# EAGLE design industrialSensorModule (EAGLE 7.1.0)
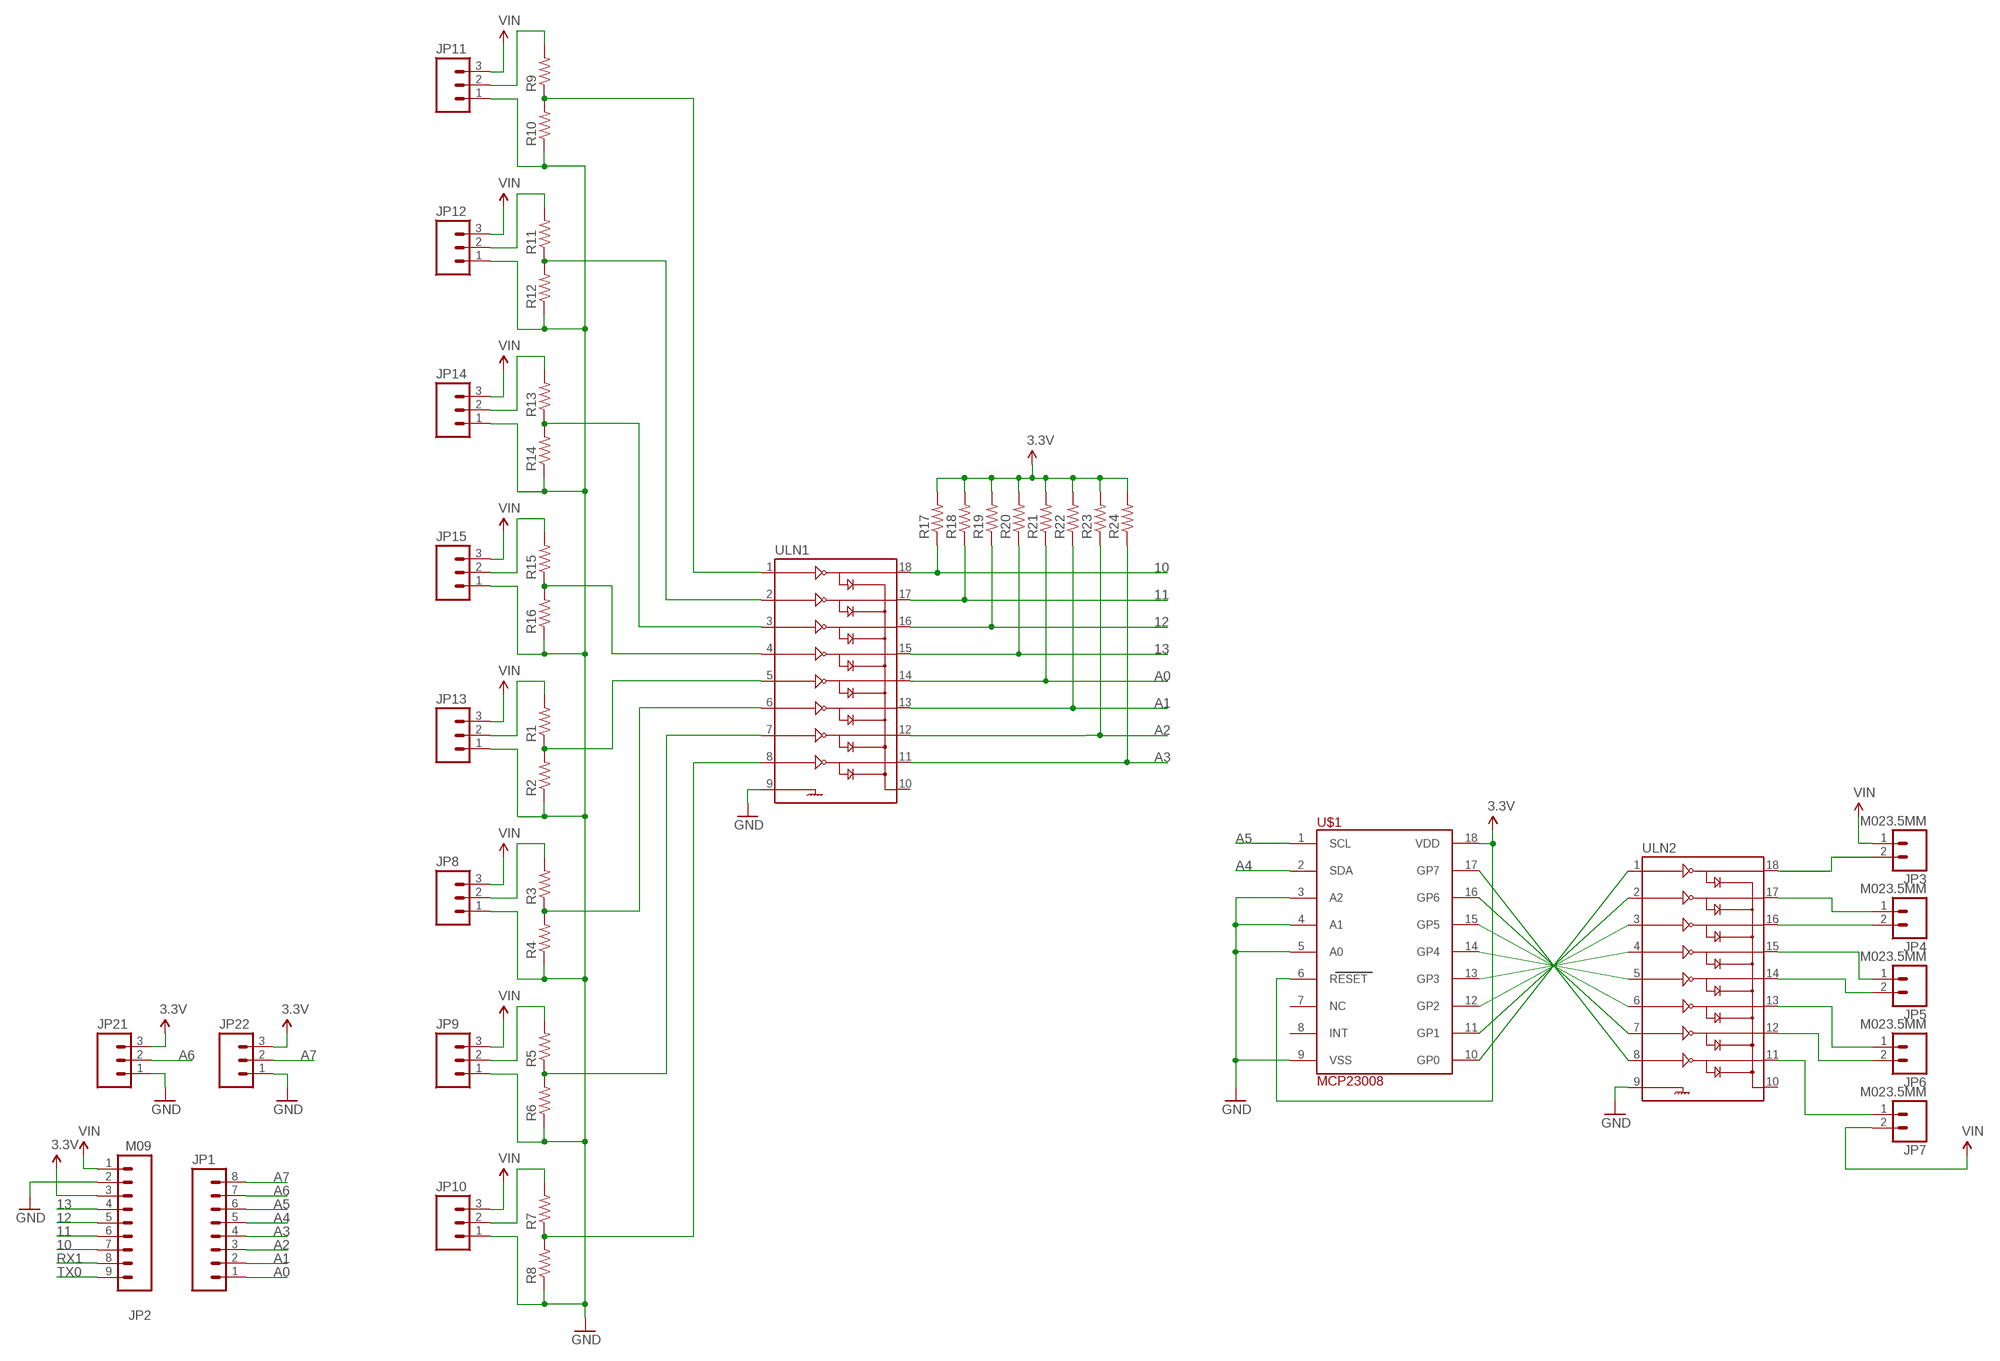
[diagram p0: schematic, sheet 1]

## Parts
JP1  M081X08  [1X08]
JP2  M09  [1X09]
JP3  M023.5MM  [SCREWTERMINAL-3.5MM-2]
JP4  M023.5MM  [SCREWTERMINAL-3.5MM-2]
JP5  M023.5MM  [SCREWTERMINAL-3.5MM-2]
JP6  M023.5MM  [SCREWTERMINAL-3.5MM-2]
JP7  M023.5MM  [SCREWTERMINAL-3.5MM-2]
JP8  M03SCREW  [SCREWTERMINAL-3.5MM-3]
JP9  M03SCREW  [SCREWTERMINAL-3.5MM-3]
JP10  M03SCREW  [SCREWTERMINAL-3.5MM-3]
JP11  M03SCREW  [SCREWTERMINAL-3.5MM-3]
JP12  M03SCREW  [SCREWTERMINAL-3.5MM-3]
JP13  M03SCREW  [SCREWTERMINAL-3.5MM-3]
JP14  M03SCREW  [SCREWTERMINAL-3.5MM-3]
JP15  M03SCREW  [SCREWTERMINAL-3.5MM-3]
JP21  M03SCREW  [SCREWTERMINAL-3.5MM-3]
JP22  M03SCREW  [SCREWTERMINAL-3.5MM-3]
R1  RESISTOR1206  [1206]
R2  RESISTOR1206  [1206]
R3  RESISTOR1206  [1206]
R4  RESISTOR1206  [1206]
R5  RESISTOR1206  [1206]
R6  RESISTOR1206  [1206]
R7  RESISTOR1206  [1206]
R8  RESISTOR1206  [1206]
R9  RESISTOR1206  [1206]
R10  RESISTOR1206  [1206]
R11  RESISTOR1206  [1206]
R12  RESISTOR1206  [1206]
R13  RESISTOR1206  [1206]
R14  RESISTOR1206  [1206]
R15  RESISTOR1206  [1206]
R16  RESISTOR1206  [1206]
R17  RESISTOR1206  [1206]
R18  RESISTOR1206  [1206]
R19  RESISTOR1206  [1206]
R20  RESISTOR1206  [1206]
R21  RESISTOR1206  [1206]
R22  RESISTOR1206  [1206]
R23  RESISTOR1206  [1206]
R24  RESISTOR1206  [1206]
U$1  MCP23008  [SOICW-18]
ULN1  ULN2803SOICW  [SO18L]
ULN2  ULN2803SOICW  [SO18L]

## Nets
3.3V: JP2.3 JP21.3 JP22.3 R17.2 R18.2 R19.2 R20.2 R21.2 R22.2 R23.2 R24.2 U$1.6(RESET) U$1.18(VDD)
10: JP2.7 R17.1 ULN1.18
11: JP2.6 R18.1 ULN1.17
12: JP2.5 R19.1 ULN1.16
13: JP2.4 R20.1 ULN1.15
A0: JP1.1 R21.1 ULN1.14
A1: JP1.2 R22.1 ULN1.13
A2: JP1.3 R23.1 ULN1.12
A3: JP1.4 R24.1 ULN1.11
A4: JP1.5 U$1.2(SDA)
A5: JP1.6 U$1.1(SCL)
A6: JP1.7 JP21.2
A7: JP1.8 JP22.2
GND: JP2.2 JP8.1 JP9.1 JP10.1 JP11.1 JP12.1 JP13.1 JP14.1 JP15.1 JP21.1 JP22.1 R2.1 R4.1 R6.1 R8.1 R10.1 R12.1 R14.1 R16.1 U$1.3(A2) U$1.4(A1) U$1.5(A0) U$1.9(VSS) ULN1.9 ULN2.9
N$1: R1.1 R2.2 ULN1.5
N$2: JP13.2 R1.2
N$4: R3.1 R4.2 ULN1.6
N$5: JP8.2 R3.2
N$7: R5.1 R6.2 ULN1.7
N$8: JP9.2 R5.2
N$10: R7.1 R8.2 ULN1.8
N$11: JP10.2 R7.2
N$13: R9.1 R10.2 ULN1.1
N$14: JP11.2 R9.2
N$16: R11.1 R12.2 ULN1.2
N$17: JP12.2 R11.2
N$19: R13.1 R14.2 ULN1.3
N$20: JP14.2 R13.2
N$22: R15.1 R16.2 ULN1.4
N$23: JP15.2 R15.2
N$25: U$1.10(GP0) ULN2.1
N$26: U$1.11(GP1) ULN2.2
N$27: U$1.12(GP2) ULN2.3
N$28: U$1.13(GP3) ULN2.4
N$29: U$1.14(GP4) ULN2.5
N$30: U$1.15(GP5) ULN2.6
N$31: U$1.16(GP6) ULN2.7
N$32: U$1.17(GP7) ULN2.8
N$33: JP3.2 ULN2.18
N$34: JP4.1 ULN2.17
N$35: JP4.2 ULN2.16
N$36: JP5.1 ULN2.15
N$37: JP5.2 ULN2.14
N$38: JP6.1 ULN2.13
N$39: JP6.2 ULN2.12
N$40: JP7.1 ULN2.11
RX1: JP2.8
TX0: JP2.9
VIN: JP2.1 JP3.1 JP7.2 JP8.3 JP9.3 JP10.3 JP11.3 JP12.3 JP13.3 JP14.3 JP15.3
Unconnected: U$1.7(NC) U$1.8(INT) ULN1.10 ULN2.10

## Library data of the parts
JP1 = SparkFun-Connectors:M08: Header 8 Standard 8-pin 0.1" header. Use with straight break away headers (SKU : PRT-00116), right angle break away headers (PRT-00553), swiss pins (PRT-00743), machine pins (PRT-00117), and female headers (PRT-00115).
JP2 = SparkFun-Connectors:M09: Header 9 Standard 9-pin 0.1" header. Use with straight break away headers (SKU : PRT-00116), right angle break away headers (PRT-00553), swiss pins (PRT-00743), machine pins (PRT-00117), and female headers (PRT-00115).
JP3-JP7 = SparkFun-Connectors:M02: Standard 2-pin 0.1" header. Use with - straight break away headers ( PRT-00116) - right angle break away headers (PRT-00553) - swiss pins (PRT-00743) - machine pins (PRT-00117) - female headers (PRT-00115) Molex polarized connector foot print use with: PRT-08233 with associated crimp pins and housings. 2.54_SCREWTERM for use with PRT-10571. 3.5mm Screw Terminal footprints for PRT-08084 5mm Screw Terminal footprints for use with PRT-08433
JP8-JP15 JP21 JP22 = SparkFun-Connectors:M03: Header 3 Standard 3-pin 0.1" header. Use with straight break away headers (SKU : PRT-00116), right angle break away headers (PRT-00553), swiss pins (PRT-00743), machine pins (PRT-00117), and female headers (PRT-00115). Molex polarized connector foot print use with SKU : PRT-08232 with associated crimp pins and housings.
R1-R24 = SparkFun-Passives:RESISTOR: Resistor Basic schematic elements and footprints for 0603, 1206, and PTH resistors.
U$1 = myLibrary:MCP23008
ULN1 ULN2 = SparkFun-PowerIC:ULN2803: Darlington Driver ULN2803 Darlington array. 500mA max per channel, 8-channel package. Spark Fun Electronics SKU : COM-00312

## Board
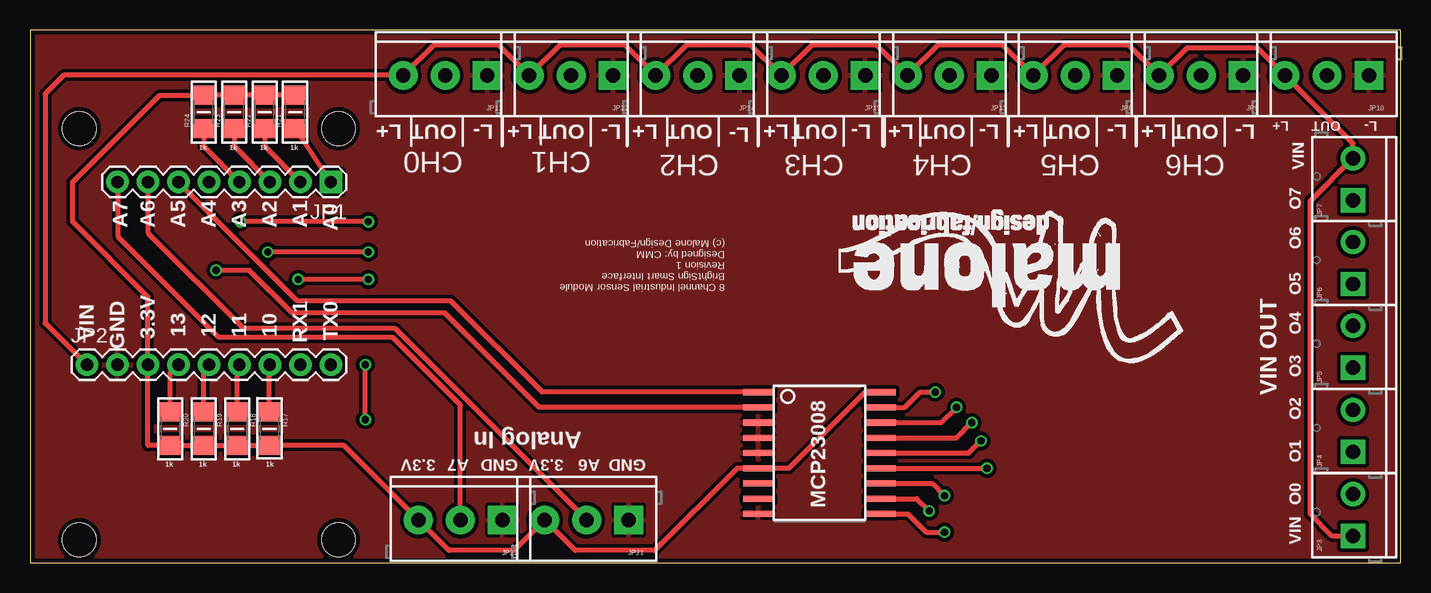
[diagram p1: board, top side]
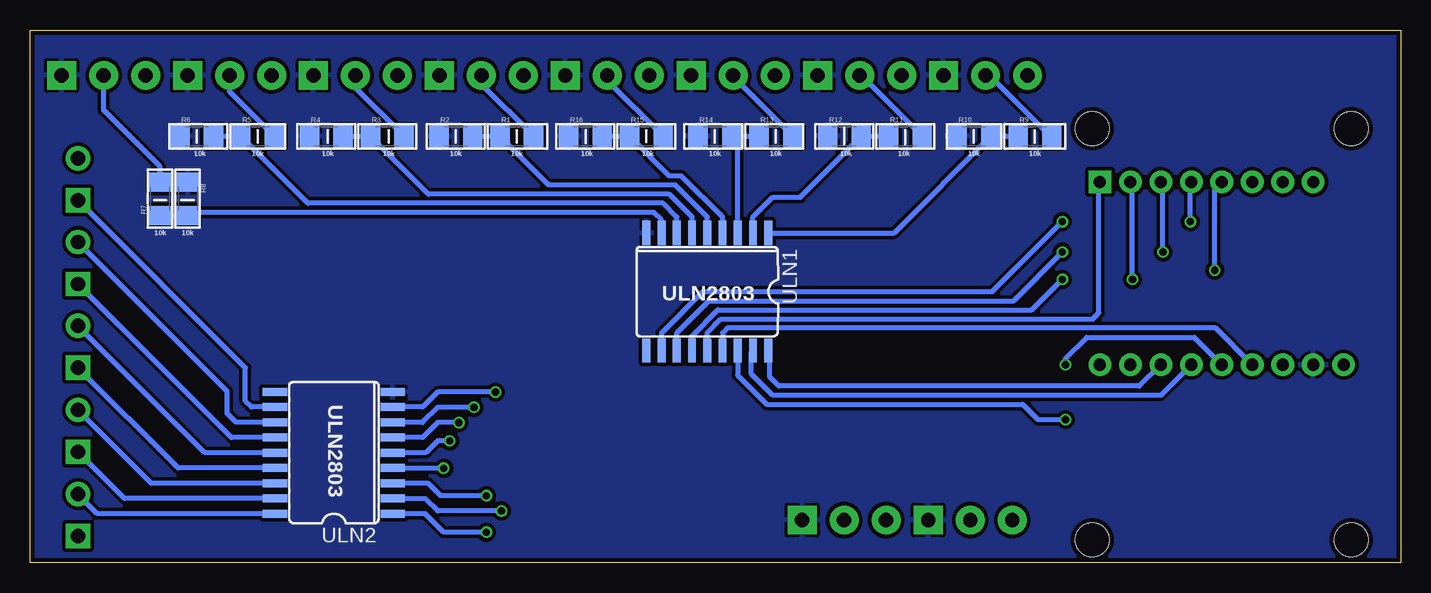
[diagram p2: board, bottom side, seen from below]

Size 114.22 x 44.43 mm. Coordinates in mm from the lower left corner, seen from the top.
Outline: 114.22,0 114.22,44.43 0,44.43 0,0 114.22,0
Copper layers (1*16): Top 0.0356mm / dielectric 1.5011mm / Bottom 0.0356mm
Design rules "LaenPCBOrder": minimum track width 6mil, minimum drill 13mil, track to track 6mil, track to pad 6mil, pad to pad 6mil, via to via 6mil, smd to smd 6mil, copper to edge 15mil, drill to drill 6mil, minimum pad ring 7mil, minimum via ring 7mil, stop-mask expansion 3mil, vias tented up to drill 0mil, thermal gap 10mil
Holes 2.8 mm at 25.7,1.91 25.7,36.2 4.12,1.91 4.12,36.2

### Footprints (pad centres in the part's own frame; a part is rotated, then mirrored left to right if it is on the bottom)
1X08 = drill 1.016 pad 1.88 square: 1 0,0 | drill 1.016 pad 1.88: 2 2.54,0; 3 5.08,0; 4 7.62,0; 5 10.16,0; 6 12.7,0; 7 15.24,0; 8 17.78,0
1X09 = drill 1.016 pad 1.88: 1 0,0; 2 2.54,0; 3 5.08,0; 4 7.62,0; 5 10.16,0; 6 12.7,0; 7 15.24,0; 8 17.78,0; 9 20.32,0
SCREWTERMINAL-3.5MM-2 = drill 1.2 pad 2.032 square: 1 0,0 | drill 1.2 pad 2.032: 2 3.5,0
SCREWTERMINAL-3.5MM-3 = drill 1.2 pad 2.413 square: 1 0,0 | drill 1.2 pad 2.413: 2 3.5,0; 3 7,0
1206 = smd 1.6 x 1.8: 1 -1.4,0; 2 1.4,0
SOICW-18 = smd 2.54 x 0.508: 1 -5.08,5.08; 2 -5.08,3.81; 3 -5.08,2.54; 4 -5.08,1.27; 5 -5.08,0; 6 -5.08,-1.27; 7 -5.08,-2.54; 8 -5.08,-3.81; 9 -5.08,-5.08; 10 5.08,-5.08; 11 5.08,-3.81; 12 5.08,-2.54; 13 5.08,-1.27; 14 5.08,0; 15 5.08,1.27; 16 5.08,2.54; 17 5.08,3.81; 18 5.08,5.08
SO18L = smd 0.66 x 2.032: 1 -0.635,-4.902; 2 0.635,-4.902; 3 1.905,-4.902; 4 3.175,-4.902; 5 4.445,-4.902; 6 5.715,-4.902; 7 6.985,-4.902; 8 8.255,-4.902; 9 9.525,-4.902; 10 9.525,4.902; 11 8.255,4.902; 12 6.985,4.902; 13 5.715,4.902; 14 4.445,4.902; 15 3.175,4.902; 16 1.905,4.902; 17 0.635,4.902; 18 -0.635,4.902

### Placement (x,y rotation side)
JP1  25.07,31.75 180 top
JP2  4.75,16.51 0 top
JP3  110.24,2.21 90 top
JP4  110.24,9.25 90 top
JP5  110.24,16.26 90 top
JP6  110.24,23.24 90 top
JP7  110.24,30.23 90 top
JP8  90.6,40.64 180 top
JP9  101.09,40.64 180 top
JP10  111.58,40.64 180 top
JP11  38.1,40.64 180 top
JP12  48.59,40.64 180 top
JP13  80.11,40.64 180 top
JP14  59.13,40.64 180 top
JP15  69.62,40.64 180 top
JP21  49.89,3.56 180 top
JP22  39.37,3.56 180 top
R1  73.66,35.56 0 bottom
R2  78.74,35.56 0 bottom
R3  84.46,35.56 0 bottom
R4  89.54,35.56 0 bottom
R5  95.25,35.56 0 bottom
R6  100.33,35.56 0 bottom
R7  103.38,30.35 90 bottom
R8  101.09,30.35 270 bottom
R9  30.48,35.56 0 bottom
R10  35.56,35.56 0 bottom
R11  41.28,35.56 0 bottom
R12  46.36,35.56 0 bottom
R13  52.07,35.56 0 bottom
R14  57.15,35.56 0 bottom
R15  62.87,35.56 0 bottom
R16  67.95,35.56 0 bottom
R17  19.94,11.18 270 top
R18  17.27,11.18 270 top
R19  14.48,11.18 270 top
R20  11.68,11.18 270 top
R21  22.1,37.59 90 top
R22  19.56,37.59 90 top
R23  17.02,37.59 90 top
R24  14.48,37.59 90 top
U$1  65.79,9.14 0 top
U$2  [MALONE_LOGO]  96.01,30.73 180 top
ULN1  53.34,22.61 180 bottom
ULN2  88.9,4.72 90 bottom

### Tracks (layer width: path | path; a pad name or v marks a point on that pad's centre or on a via)
3.3V
  Top 0.406: R21.2 R22.2 R23.2 R24.2 10.8,38.99 3.56,31.75 3.56,28.45 9.83,22.17 JP2.3 9.83,9.78 R20.2 R19.2 R18.2 R17.2 26.15,9.78 JP22.3 34.91,1.02 40.35,1.02 JP21.3 45.43,1.02 52.07,1.02 58.93,7.87 U$1.6 63.25,7.87 69.6,14.22 U$1.18
10
  Top 0.406: R17.1 19.94,16.46 JP2.7
  Bottom 0.406: JP2.7 21.77,14.73 51.82,14.73 52.58,15.49 52.58,17.58 ULN1.18
11
  Top 0.406: R18.1 17.27,16.33 JP2.6
  Bottom 0.406: JP2.6 19.99,13.97 52.32,13.97 54.1,15.75 54.1,17.58 ULN1.17
12  (via drill 0.6)
  Top 0.406: R19.1 14.48,16.08 JP2.5 | v27.94,11.94 v27.94,16.51
  Bottom 0.406: ULN1.16 55.25,15.62 52.83,13.21 31.5,13.21 30.23,11.94 v27.94,11.94 | v27.94,16.51 27.94,17.02 26.16,18.8 17.2,18.8 JP2.5
13
  Top 0.406: R20.1 11.68,15.82 JP2.4
  Bottom 0.406: JP2.4 15.42,19.56 56.13,19.56 56.52,19.18 ULN1.15
A0
  Top 0.406: R21.1 JP1.1
  Bottom 0.406: ULN1.14 57.79,19.18 56.64,20.32 25.65,20.32 25.15,20.83 25.15,31.67 JP1.1
A1  (via drill 0.6)
  Top 0.406: R22.1 19.56,34.72 JP1.2 | v28.19,23.62 v22.35,23.62
  Bottom 0.406: ULN1.13 59.06,18.92 56.9,21.08 30.73,21.08 v28.19,23.62 | v22.35,23.62 22.35,31.57 JP1.2
A2  (via drill 0.6)
  Top 0.406: R23.1 17.02,34.72 JP1.3 | v28.19,25.91 v19.81,25.91
  Bottom 0.406: ULN1.12 60.33,19.18 57.66,21.84 32.26,21.84 v28.19,25.91 | v19.81,25.91 19.81,31.57 JP1.3
A3  (via drill 0.6)
  Top 0.406: R24.1 14.48,34.72 JP1.4 | v28.19,28.45 v17.53,28.45
  Bottom 0.406: ULN1.11 61.6,19.18 58.17,22.61 34.04,22.61 v28.19,28.45 | v17.53,28.45 17.53,31.67 JP1.4
A4  (via drill 0.6)
  Top 0.406: U$1.2 42.42,12.95 34.54,20.83 21.84,20.83 18.29,24.38 v15.49,24.38
  Bottom 0.406: v15.49,24.38 15.49,31.17 JP1.5
A5
  Top 0.406: U$1.1 42.67,14.22 35.05,21.84 22.28,21.84 JP1.6
A6
  Top 0.406: JP1.7 9.83,27.51 17.78,19.56 30.38,19.56 JP21.2
A7
  Top 0.406: JP22.2 35.87,13.15 30.23,18.8 15.75,18.8 7.37,27.18 7.37,31.67 JP1.8
GND
  pour Bottom (isolate 0.305): 0,44.45 114.22,44.45 114.22,0 0,0
  pour Top (isolate 0.305): 0,0 114.22,0 114.22,44.42 0,44.42
N$1
  Bottom 0.406: R2.2 R1.1 71,31.5 60.45,31.5 57.79,28.83 ULN1.5
N$2
  Bottom 0.406: R1.2 76.61,39.91 JP13.2
N$4
  Bottom 0.406: R4.2 R3.1 81.03,30.73 60.96,30.73 59.06,28.83 ULN1.6
N$5
  Bottom 0.406: R3.2 87.1,39.61 JP8.2
N$7
  Bottom 0.406: R6.2 R5.1 91.06,29.97 61.47,29.97 60.33,28.83 ULN1.7
N$8
  Bottom 0.406: R5.2 97.59,39.3 JP9.2
N$10
  Bottom 0.406: R7.1 R8.2 100.84,29.21 62.23,29.21 61.6,28.57 ULN1.8
N$11
  Bottom 0.406: R7.2 103.38,33.02 108.08,37.72 JP10.2
N$13
  Bottom 0.406: R9.1 R10.2 42.21,27.51 ULN1.1
N$14
  Bottom 0.406: R9.2 29.21,35.56 34.29,40.64 JP11.2
N$16
  Bottom 0.406: R11.1 R12.2 50.04,30.48 52.32,30.48 53.98,28.83 ULN1.2
N$17
  Bottom 0.406: R11.2 44.96,40.64 JP12.2
N$19
  Bottom 0.406: R13.1 R14.2 55.25,35.05 ULN1.3
N$20
  Bottom 0.406: R13.2 55.63,40.52 JP14.2
N$22
  Bottom 0.406: R16.2 R15.1 60.96,32.26 59.94,32.26 56.52,28.83 ULN1.4
N$23
  Bottom 0.406: R15.2 66.12,40.22 JP15.2
N$25  (via drill 0.6)
  Top 0.406: U$1.10 73.15,4.06 74.68,2.54 v76.2,2.54
  Bottom 0.406: v76.2,2.54 79.76,2.54 81.31,4.09 ULN2.1
N$26  (via drill 0.6)
  Top 0.406: U$1.11 73.91,5.33 v74.93,4.32
  Bottom 0.406: v74.93,4.32 80.26,4.32 81.28,5.33 83.97,5.33 ULN2.2
N$27  (via drill 0.6)
  Top 0.406: U$1.12 75.18,6.6 v76.2,5.59
  Bottom 0.406: v76.2,5.59 80.01,5.59 81.03,6.6 83.97,6.6 ULN2.3
N$28  (via drill 0.6)
  Top 0.406: U$1.13 v79.76,7.87
  Bottom 0.406: v79.76,7.87 83.97,7.87 ULN2.4
N$29  (via drill 0.6)
  Top 0.406: U$1.14 78.23,9.14 v79.25,10.16
  Bottom 0.406: v79.25,10.16 80.26,10.16 81.26,9.17 ULN2.5
N$30  (via drill 0.6)
  Top 0.406: U$1.15 77.22,10.41 v78.49,11.68
  Bottom 0.406: v78.49,11.68 80.26,11.68 81.51,10.44 ULN2.6
N$31  (via drill 0.6)
  Top 0.406: U$1.16 75.95,11.68 v77.22,12.95
  Bottom 0.406: v77.22,12.95 80.26,12.95 81.53,11.68 81.56,11.71 ULN2.7
N$32  (via drill 0.6)
  Top 0.406: U$1.17 72.9,12.95 74.17,14.22 v75.44,14.22
  Bottom 0.406: v75.44,14.22 80.26,14.22 81.51,12.98 ULN2.8
N$33
  Bottom 0.406: ULN2.18 108.62,4.09 JP3.2
N$34
  Bottom 0.406: ULN2.17 106.35,5.36 JP4.1
N$35
  Bottom 0.406: ULN2.16 104.12,6.63 JP4.2
N$36
  Bottom 0.406: ULN2.15 101.88,7.9 JP5.1
N$37
  Bottom 0.406: ULN2.14 99.65,9.17 JP5.2
N$38
  Bottom 0.406: ULN2.13 97.43,10.44 JP6.1
N$39
  Bottom 0.406: ULN2.12 97.05,11.71 97.79,12.45 97.79,14.29 JP6.2
N$40
  Bottom 0.406: ULN2.11 95.78,12.98 96.27,13.46 96.27,16.26 JP7.1
VIN
  Top 0.406: JP3.1 108.53,2.21 106.68,4.06 106.68,30.17 JP7.2 110.24,34.99 JP10.3 102.3,42.93 96.38,42.93 JP9.3 91.55,43.18 86.14,43.18 JP8.3 81.06,43.18 75.65,43.18 JP13.3 70.57,43.18 65.16,43.18 JP15.3 60.08,43.18 54.67,43.18 JP14.3 49.59,43.18 44.13,43.18 JP12.3 39.05,43.18 33.64,43.18 JP11.3 2.79,40.64 1.27,39.12 1.27,19.99 JP2.1

### Text on the board
_tsilk: L+ | OUT | L- | L+ | OUT | L- | L+ | OUT | L+ | OUT | L- | L+ | OUT | L- | L+ | OUT | L- | L+ | OUT | L- | L+ | OUT | L- | L- | 1k | 1k | 1k | 1k | CH0 | CH1 | CH2 | CH3 | CH4 | CH5 | CH6 | VIN | A7 | A6 | A5 | A4 | A3 | A2 | A1 | A0 | O7 | 8 Channel Industrial Sensor Module / BrightSign Smart Interface / Revision 1 / Designed by: CMM / (c) Malone Design/Fabrication | O6 | VIN | GND | 3.3V | RX1 | TX0 | O5 | 13 | 12 | 11 | 10 | O4 | O3 | VIN OUT | O2 | Analog In | 3.3V | A7 | GND | 3.3V | A6 | GND | 1k | 1k | 1k | 1k | O1 | MCP23008 | O0 | VIN
_bsilk: 10k | 10k | 10k | 10k | 10k | 10k | 10k | 10k | 10k | 10k | 10k | 10k | 10k | 10k | 10k | 10k | ULN2803 | ULN2803